# EAGLE schematic MRCS-Nano-Ard-Relay-Breakout (EAGLE 7.7.0)
PCR Clinic board
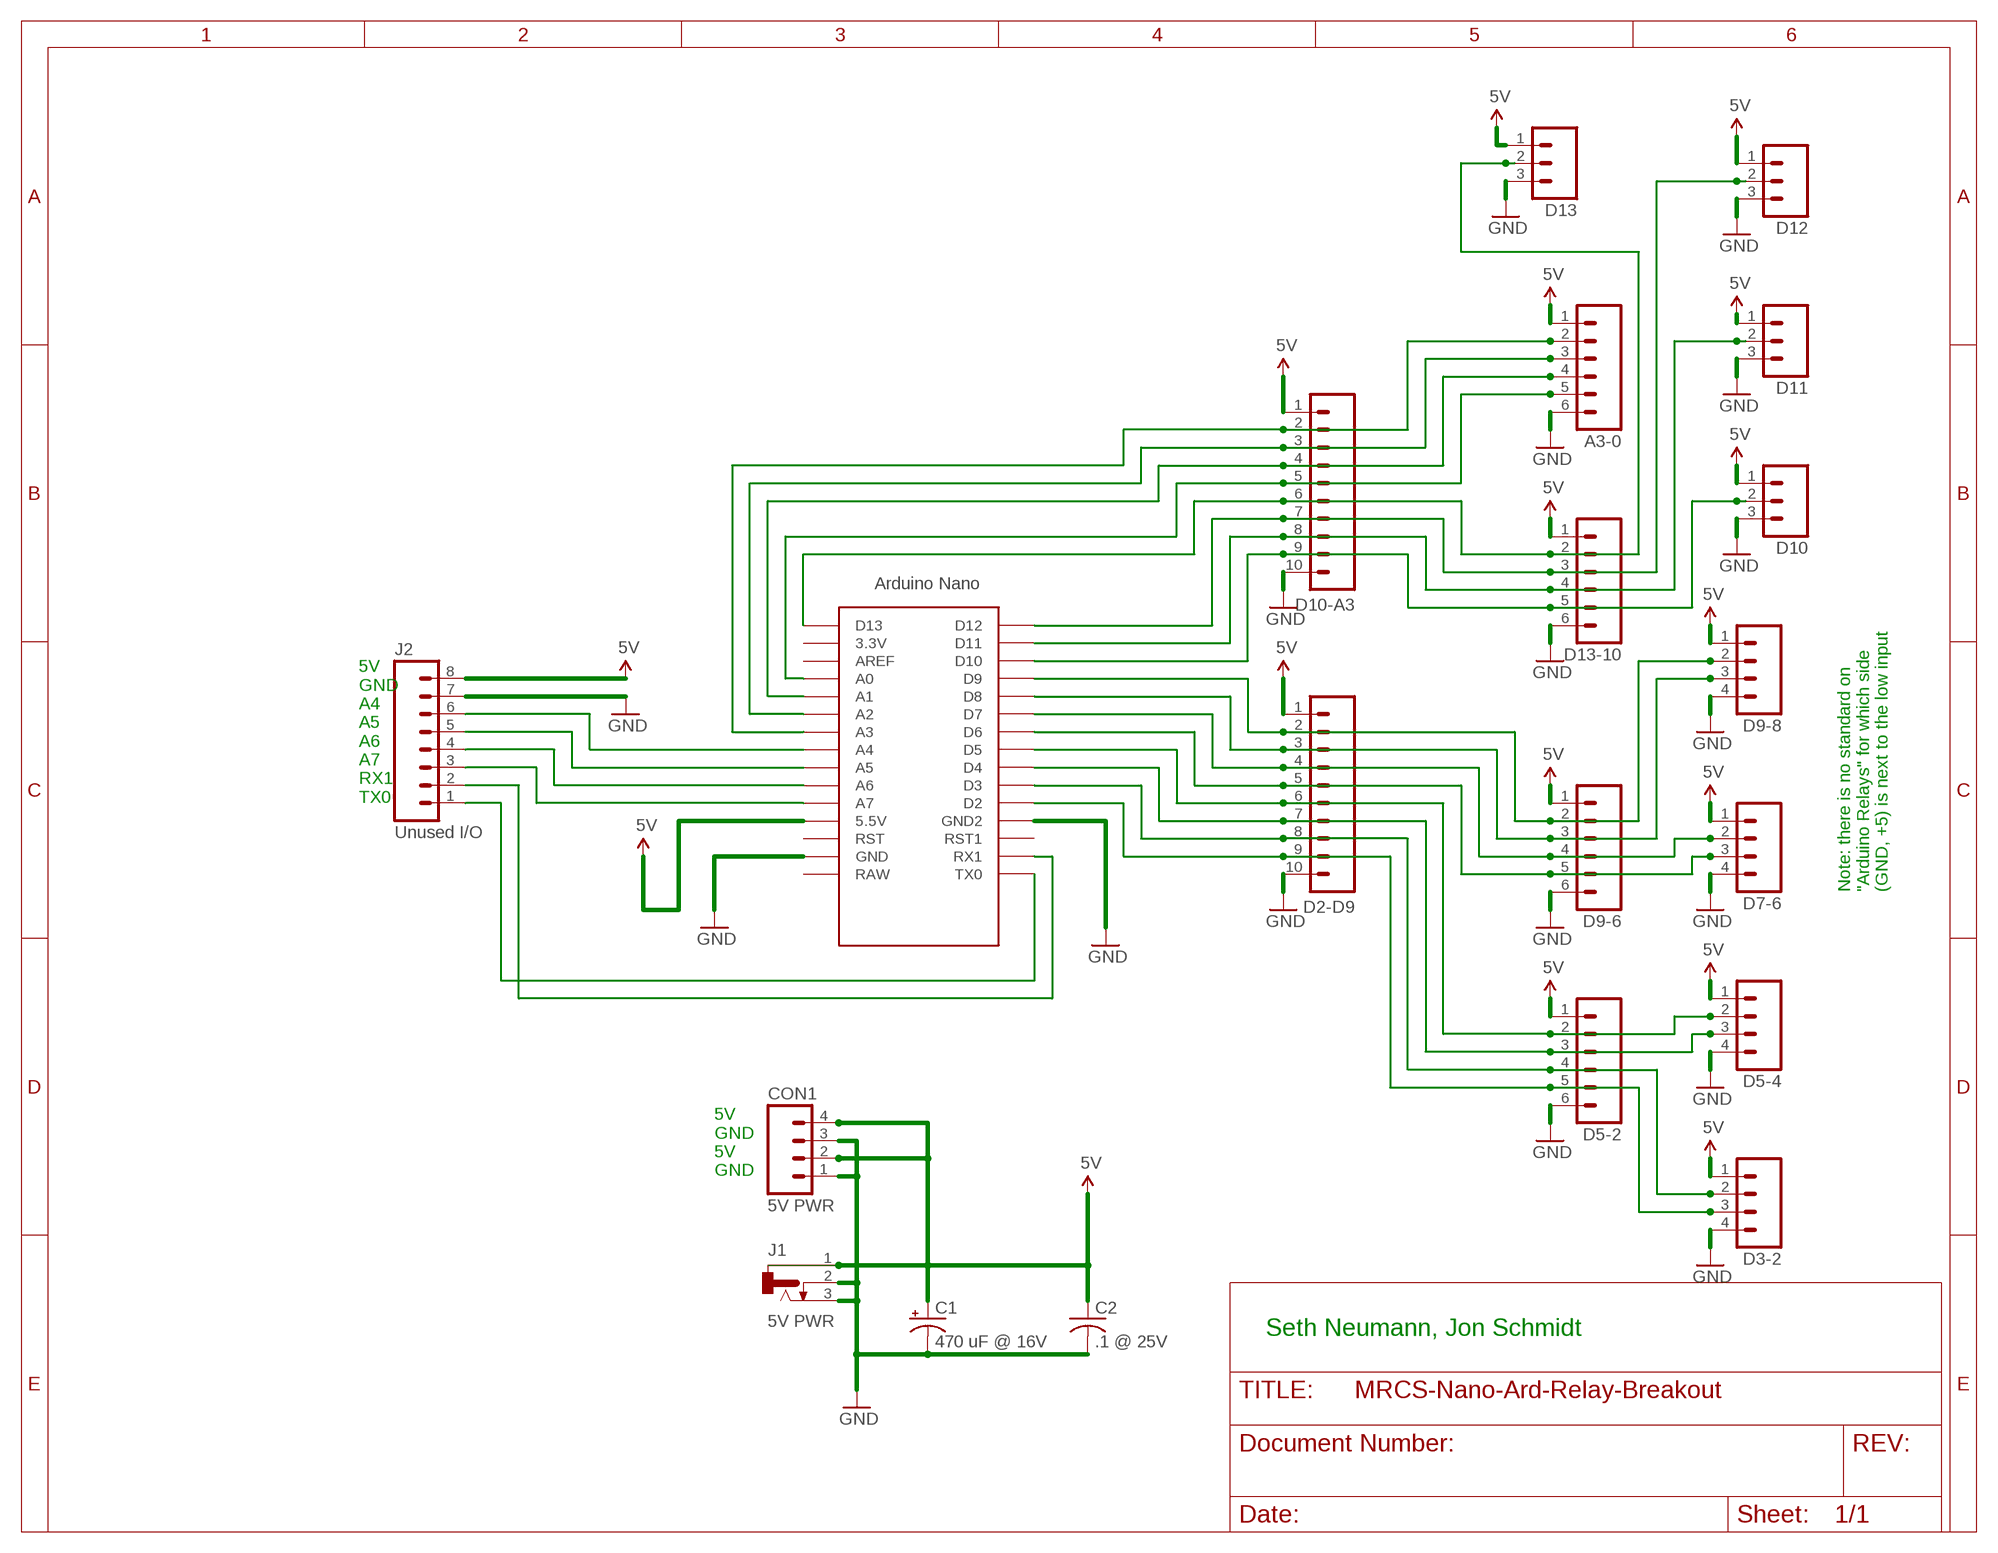
[diagram p0: schematic, sheet 1]

## Parts
A3-0  CONNECTOR-M06LOCK  [1X06_LOCK]
C1  470 uF @ 16V  CAP-POLPTH-3.5MM  [E3.5-10]
C2  .1 @ 25V  CAPPTH2  [C-PTH-0.100]
CON1  5V PWR  CONNECTOR-M04SCREW_LOCK  [SCREWTERMINAL-3.5MM-4_LOCK]
D2-D9  CONNECTOR-M102MM  [1X10-2MM]
D3-2  CONNECTOR-M04LOCK  [1X04_LOCK]
D5-2  CONNECTOR-M06LOCK  [1X06_LOCK]
D5-4  CONNECTOR-M04LOCK  [1X04_LOCK]
D7-6  CONNECTOR-M04LOCK  [1X04_LOCK]
D9-6  CONNECTOR-M06LOCK  [1X06_LOCK]
D9-8  CONNECTOR-M04LOCK  [1X04_LOCK]
D10  CONNECTOR-M03MOLEX-254-LOCK  [MOLEX-1X3_LOCK]
D10-A3  CONNECTOR-M102MM  [1X10-2MM]
D11  CONNECTOR-M03MOLEX-254-LOCK  [MOLEX-1X3_LOCK]
D12  CONNECTOR-M03MOLEX-254-LOCK  [MOLEX-1X3_LOCK]
D13  CONNECTOR-M03MOLEX-254-LOCK  [MOLEX-1X3_LOCK]
D13-10  CONNECTOR-M06LOCK  [1X06_LOCK]
J1  5V PWR  CONNECTOR-DC-POWER-RA  [DCJ0202]
J2  Unused I/O  CONNECTOR-M08LOCK  [1X08_LOCK]
U$1  NANO  [NANO]

## Nets
5V [Power]: A3-0.1 C1.+ C2.1 CON1.2 CON1.4 D2-D9.1 D3-2.1 D5-2.1 D5-4.1 D7-6.1 D9-6.1 D9-8.1 D10-A3.1 D10.1 D11.1 D12.1 D13-10.1 D13.1 J1.1 J2.8 U$1.5V(5.5V)
A4: J2.6 U$1.A4
A5: J2.5 U$1.A5
A6: J2.4 U$1.A6
A7: J2.3 U$1.A7
GND [Power]: A3-0.6 C1.- C2.2 CON1.1 CON1.3 D2-D9.10 D3-2.4 D5-2.6 D5-4.4 D7-6.4 D9-6.6 D9-8.4 D10-A3.10 D10.3 D11.3 D12.3 D13-10.6 D13.3 J1.2 J1.3 J2.7 U$1.GND U$1.GND1(GND2)
N$3: D2-D9.9 D3-2.3 D5-2.5 U$1.D2
N$4: D2-D9.8 D3-2.2 D5-2.4 U$1.D3
N$7: D2-D9.5 D7-6.3 D9-6.5 U$1.D6
N$8: D2-D9.4 D7-6.2 D9-6.4 U$1.D7
N$9: D2-D9.3 D9-6.3 D9-8.3 U$1.D8
N$10: D2-D9.2 D9-6.2 D9-8.2 U$1.D9
N$11: D10-A3.9 D10.2 D13-10.5 U$1.D10
N$12: D10-A3.8 D11.2 D13-10.4 U$1.D11
N$13: D10-A3.7 D12.2 D13-10.3 U$1.D12
N$14: D10-A3.6 D13-10.2 D13.2 U$1.D13
N$15: A3-0.5 D10-A3.5 U$1.A0
N$16: A3-0.4 D10-A3.4 U$1.A1
N$17: A3-0.3 D10-A3.3 U$1.A2
N$18: A3-0.2 D10-A3.2 U$1.A3
N$19: D2-D9.7 D5-2.3 D5-4.3 U$1.D4
N$23: D2-D9.6 D5-2.2 D5-4.2 U$1.D5
RX1: J2.2 U$1.RX1
TX0: J2.1 U$1.TX0
Unconnected: U$1.3.3V U$1.AREF U$1.RAW U$1.RST U$1.RST1

## Notes on the sheet
- 5V
  GND
  A4
  A5
  A6
  A7
  RX1
  TX0
- Note: there is no standard on
  "Arduino Relays" for which side
  (GND, +5) is next to the low input
- 5V
  GND
  5V
  GND
- Seth Neumann, Jon Schmidt

## Library data of the parts
A3-0 D5-2 D9-6 D13-10 = SPCoast:CONNECTOR-M06: Header 6 Standard 6-pin 0.1" header
C1 = SPCoast:CAP-POL*
C2 = SPCoast:CAP*
CON1 D3-2 D5-4 D7-6 D9-8 = SPCoast:CONNECTOR-M04: Header 4 Standard 4-pin 0.1" header. Use with straight break away headers (SKU : PRT-00116), right angle break away headers (PRT-00553), swiss pins (PRT-00743), machine pins (PRT-00117), and female headers (PRT-00115). Molex polarized connector foot print use with SKU : PRT-08231 with associated crimp pins and housings. 1MM SMD Version SKU: PRT-10208
D2-D9 D10-A3 = SPCoast:CONNECTOR-M10: Header 10 Standard 10-pin 0.1" header. Use with straight break away headers (SKU : PRT-00116), right angle break away headers (PRT-00553), swiss pins (PRT-00743), machine pins (PRT-00117), and female headers (PRT-00115).
D10-D13 = SPCoast:CONNECTOR-M03
J1 = SPCoast:CONNECTOR-DC-POWER: DC POWER JACK Source: DCJ0202.pdf
J2 = SPCoast:CONNECTOR-M08: Header 8 Standard 8-pin 0.1" header. Use with straight break away headers (SKU : PRT-00116), right angle break away headers (PRT-00553), swiss pins (PRT-00743), machine pins (PRT-00117), and female headers (PRT-00115).
U$1 = Arduino-clone-scn:NANO: Arduino Nano

## Net classes
0 default: width 0.305 mm
1 Power: width 0.61 mm